# Altium project Monitor_Board_Model_temporary_H202.PrjPcb (part 1 of 3)
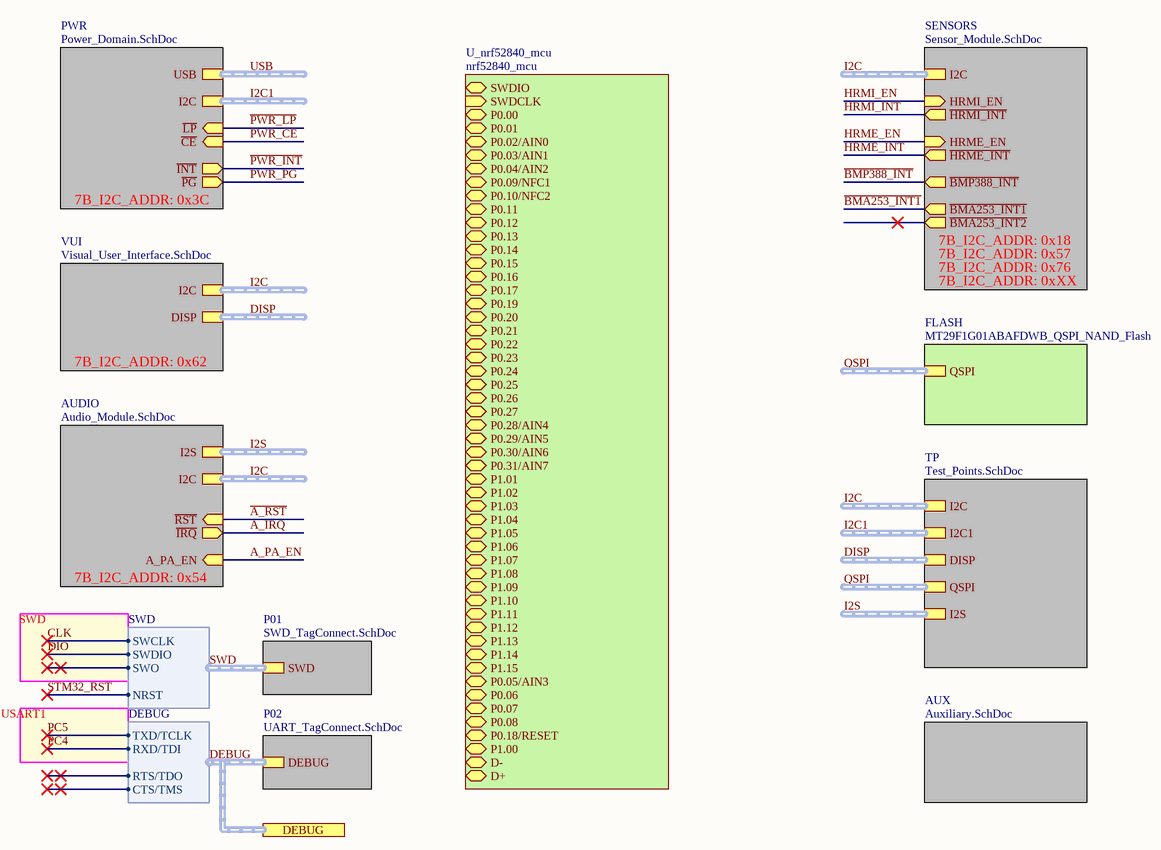
[diagram p0: Top_Schematic_Sheet.SchDoc]
_Title: Monitor_Board; _Revision: 0.1; _PCBNumber: temp; _PCBModel: H202; _HWEngineer: SGU; _DocumentDate: 20210408; _DateCode: 2021.04; _CompanyName: Acme_CPU; _BoardName: Monitor_Board; _ApprovedBy: PGU; _address2: Sheridan WY 82801; _address1: 30 N Gould St suite 4000
18 sheets, 90 parts. Net scope: hierarchical (ports join the sheet entries above them; power ports are global).
Board file: H202.PcbDoc
Sheets:
  Top_Schematic_Sheet.SchDoc
    TP = Test_Points.SchDoc
    PWR = Power_Domain.SchDoc
      USB = Micro_USB_Port.SchDoc
      BC = bq25157_Battery_Charger.SchDoc
      K_PAD = Membrane_Keypad.SchDoc
    VUI = Visual_User_Interface.SchDoc
    AUX = Auxiliary.SchDoc
    AUDIO = Audio_Module.SchDoc
      MIC1 = IM69D130_MEMS_Microphone.SchDoc
      MIC2 = IM69D130_MEMS_Microphone.SchDoc
      CODEC = CMX655D_Audio_CODEC_PA.SchDoc
    SENSORS = Sensor_Module.SchDoc
      HRME = Heartrate_Monitor_External.SchDoc
      HRMI = Heartrate_Monitor_Internal.SchDoc
        HRS1 = MAX30102_Heart-Rate_Sensor.SchDoc
    P01 = SWD_TagConnect.SchDoc
    P02 = UART_TagConnect.SchDoc
  SIT1533_Oscillator.SchDoc

## Sheet Top_Schematic_Sheet.SchDoc: H201 Monitor Board Block Diagram
size A4; DocumentNumber: 1; SheetNumber: 1; SheetTotal: 31

### Sub-sheets
AUDIO = Audio_Module.SchDoc: I2S (harness I2S), I2C (harness I2C), ~{RST} (in), ~{IRQ} (out), A_PA_EN (in)  | 7B_I2C_ADDR: 0x54
AUX = Auxiliary.SchDoc: no entries
FLASH = MT29F1G01ABAFDWB_QSPI_NAND_Flash (file not in this document): QSPI (harness QSPI)
P01 = SWD_TagConnect.SchDoc: SWD (harness SWD)  | Caption: SWD
P02 = UART_TagConnect.SchDoc: DEBUG (harness DEBUG)  | Caption: DEBUG
PWR = Power_Domain.SchDoc: USB (harness USB), I2C (harness I2C), ~{LP} (in), ~{PG} (out), ~{INT} (out), ~{CE} (in)  | 7B_I2C_ADDR: 0x3C
SENSORS = Sensor_Module.SchDoc: I2C (harness I2C), ~{BMA253_INT1} (out), ~{BMP388_INT} (out), ~{BMA253_INT2} (out), ~{HRMI_INT} (out), ~{HRME_INT} (out), HRMI_EN (in), HRME_EN (in)  | 7B_I2C_ADDR: 0x57; 7B_I2C_ADDR: 0x18; 7B_I2C_ADDR: 0x76; 7B_I2C_ADDR: 0xXX
TP = Test_Points.SchDoc: I2C (harness I2C), DISP (harness DISP_SPI), QSPI (harness QSPI), I2S (harness I2S), I2C1 (harness I2C)
U_nrf52840_mcu = nrf52840_mcu (file not in this document): SWDIO (bidir), SWDCLK (in), P0.00 (bidir), P0.01 (bidir), P0.02/AIN0 (bidir), P0.03/AIN1 (bidir), P0.04/AIN2 (bidir), P0.09/NFC1 (bidir), P0.10/NFC2 (bidir), P0.11 (bidir), P0.12 (bidir), P0.13 (bidir), P0.14 (bidir), P0.15 (bidir), P0.16 (bidir), P0.17 (bidir), P0.19 (bidir), P0.20 (bidir), P0.21 (bidir), P0.22 (bidir), P0.23 (bidir), P0.24 (bidir), P0.25 (bidir), P0.26 (bidir), P0.27 (bidir), P0.28/AIN4 (bidir), P0.29/AIN5 (bidir), P0.30/AIN6 (bidir), P0.31/AIN7 (bidir), P1.01 (bidir), P1.02 (bidir), P1.03 (bidir), P1.04 (bidir), P1.05 (bidir), P1.06 (bidir), P1.07 (bidir), P1.08 (bidir), P1.09 (bidir), P1.10 (bidir), P1.11 (bidir), P1.12 (bidir), P1.13 (bidir), P1.14 (bidir), P1.15 (bidir), P0.05/AIN3 (bidir), P0.06 (bidir), P0.07 (bidir), P0.08 (bidir), P0.18/RESET (bidir), P1.00 (bidir), D- (bidir), D+ (bidir)
VUI = Visual_User_Interface.SchDoc: I2C (harness I2C), DISP (harness DISP_SPI)  | 7B_I2C_ADDR: 0x62

### Ports
DEBUG (harness DEBUG)

### Harnesses
SWD: SWDIO, SWCLK, NRST, SWO
DEBUG: TXD/TCLK, RXD/TDI, RTS/TDO, CTS/TMS

### Buses and harness runs
harness DEBUG = port DEBUG = sheet P02/DEBUG
harness DISP = sheet TP/DISP
harness DISP = sheet VUI/DISP
harness I2C1 = sheet PWR/I2C
harness I2C1 = sheet TP/I2C1
harness I2C = sheet AUDIO/I2C
harness I2C = sheet SENSORS/I2C
harness I2C = sheet TP/I2C
harness I2C = sheet VUI/I2C
harness I2S = sheet AUDIO/I2S
harness I2S = sheet TP/I2S
harness QSPI = sheet FLASH/QSPI
harness QSPI = sheet TP/QSPI
harness SWD = sheet P01/SWD
harness USB = sheet PWR/USB

### Notes on the sheet
- SWD
- USART1
- Title
- Size:
- Date:
- A4
- Number:
- Time:
- Revision:
- Sheet
- of
- File:

## Sheet Test_Points.SchDoc: Test Points
size A4; DocumentNumber: 16; SheetNumber: 16; SheetTotal: 31
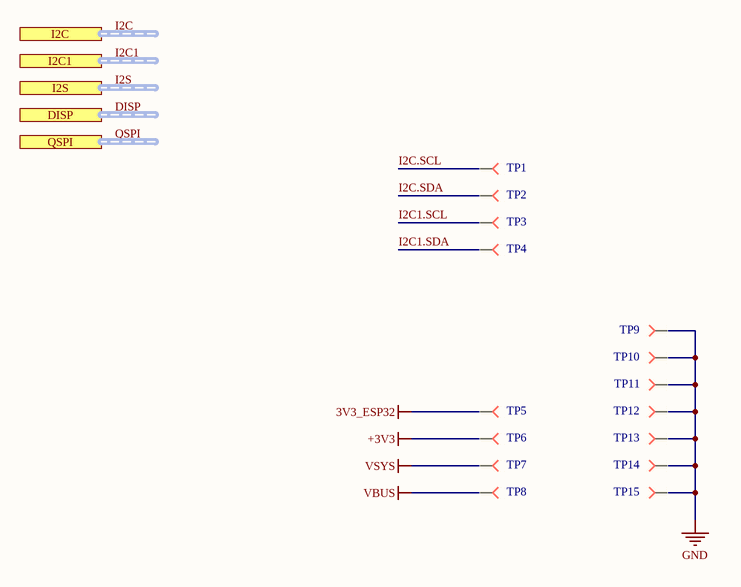
[diagram p1: Test_Points.SchDoc]

### Parts
TP1  Test Point Pad  [Testpoint]  (value not drawn)  (no BOM)
TP2  Test Point Pad  [Testpoint]  (value not drawn)  (no BOM)
TP3  Test Point Pad  [Testpoint]  (value not drawn)  (no BOM)
TP4  Test Point Pad  [Testpoint]  (value not drawn)  (no BOM)
TP5  Test Point Pad  [Testpoint]  (value not drawn)  (no BOM)
TP6  Test Point Pad  [Testpoint]  (value not drawn)  (no BOM)
TP7  Test Point Pad  [Testpoint]  (value not drawn)  (no BOM)
TP8  Test Point Pad  [Testpoint]  (value not drawn)  (no BOM)
TP9  Test Point Pad  [Testpoint]  (value not drawn)  (no BOM)
TP10  Test Point Pad  [Testpoint]  (value not drawn)  (no BOM)
TP11  Test Point Pad  [Testpoint]  (value not drawn)  (no BOM)
TP12  Test Point Pad  [Testpoint]  (value not drawn)  (no BOM)
TP13  Test Point Pad  [Testpoint]  (value not drawn)  (no BOM)
TP14  Test Point Pad  [Testpoint]  (value not drawn)  (no BOM)
TP15  Test Point Pad  [Testpoint]  (value not drawn)  (no BOM)

### Ports
DISP (harness DISP_SPI), I2C1 (harness I2C), I2C (harness I2C), I2S (harness I2S), QSPI (harness QSPI)

### Nets
3V3_ESP32: TP5.1
+3V3: TP6.1
GND: TP9.1 TP10.1 TP11.1 TP12.1 TP13.1 TP14.1 TP15.1
VBUS: TP8.1
VSYS: TP7.1
I2C1.SCL: TP3.1
I2C1.SDA: TP4.1
I2C.SCL: TP1.1
I2C.SDA: TP2.1

### Buses and harness runs
harness DISP = port DISP
harness I2C1 = port I2C1
harness I2C = port I2C
harness I2S = port I2S
harness QSPI = port QSPI

### Notes on the sheet
- Title
- Size:
- Date:
- A4
- Number:
- Time:
- Revision:
- Sheet
- of
- File:

### Library data of the parts
TP1-TP15 = Test Point Pad: Test Point. There is nothing to buy or mount.; ClassName: TestPoint; CompType: TestPoint; Manufacturer: N/A; MountType: N/A; PackageReference: TetsPoint; PartNumber: N/A

## Sheet Power_Domain.SchDoc: Power Domain
size A4; DocumentNumber: 11; SheetNumber: 11; SheetTotal: 31
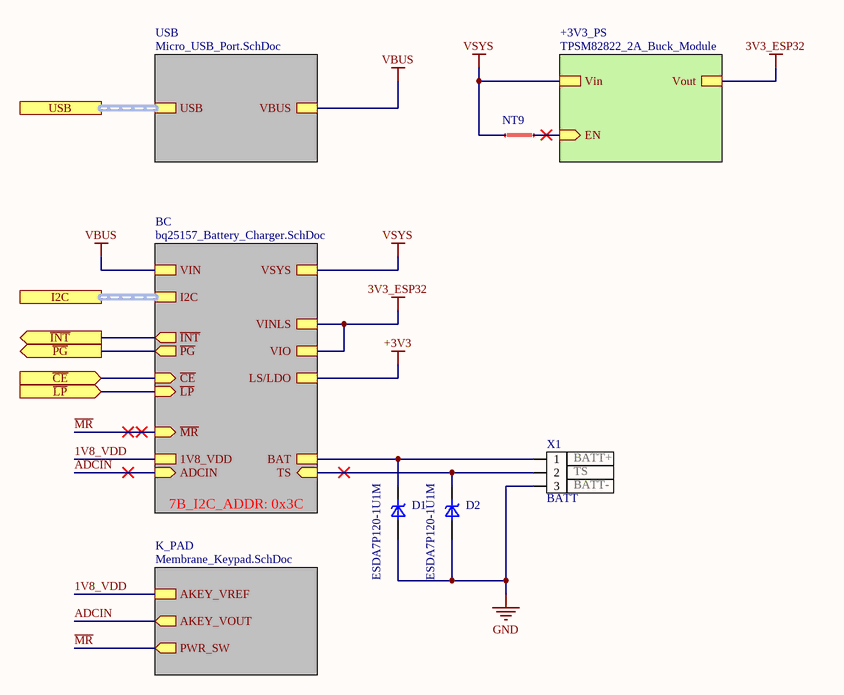
[diagram p2: Power_Domain.SchDoc]

### Parts
D1  ESDA7P120-1U1M  [ST_QFN_1610]
D2  ESDA7P120-1U1M  [ST_QFN_1610]
NT9  Net Tie  [Net Tie 1x3mm]  (value not drawn)  (net tie, no BOM)
X1  BATT  pin_1: BATT+  pin_2: TS  pin_3: BATT-  [JST_S3B-ZR-SM4A-TF]

### Sub-sheets
+3V3_PS = TPSM82822_2A_Buck_Module (file not in this document): Vout, Vin, EN (in)
BC = bq25157_Battery_Charger.SchDoc: VIN, VSYS, BAT, TS (in), ~{CE} (in), ~{LP} (in), ADCIN (in), ~{MR} (in), ~{INT} (out), ~{PG} (out), I2C (harness I2C), LS/LDO, VINLS, VIO, 1V8_VDD  | 7B_I2C_ADDR: 0x3C
K_PAD = Membrane_Keypad.SchDoc: PWR_SW (out), AKEY_VREF, AKEY_VOUT (out)
USB = Micro_USB_Port.SchDoc: USB (harness USB), VBUS

### Ports
I2C (harness I2C), USB (harness USB), ~{CE} (in), ~{INT} (out), ~{LP} (in), ~{PG} (out)

### Nets
3V3_ESP32: sheet BC/VINLS, sheet BC/VIO, sheet +3V3_PS/Vout
GND: D1.2(A) D2.2(A) X1.3
VBUS: sheet USB/VBUS, sheet BC/VIN
VSYS: NT9.2 ; sheet BC/VSYS, sheet +3V3_PS/Vin
1V8_VDD: sheet BC/1V8_VDD, sheet K_PAD/AKEY_VREF
~{MR}: sheet BC/~{MR}, sheet K_PAD/PWR_SW
~{PWR_CE}: port ~{CE}, sheet BC/~{CE}
~{PWR_INT}: port ~{INT}, sheet BC/~{INT}
~{PWR_LP}: port ~{LP}, sheet BC/~{LP}
~{PWR_PG}: port ~{PG}, sheet BC/~{PG}
ADCIN: sheet BC/ADCIN, sheet K_PAD/AKEY_VOUT
NetD1_1: D1.1(K) X1.1 ; sheet BC/BAT
NetD2_1: D2.1(K) X1.2 ; sheet BC/TS
NetNT9_1: NT9.1 ; sheet +3V3_PS/EN

### Buses and harness runs
harness port I2C = sheet BC/I2C
harness port USB = sheet USB/USB

### Notes on the sheet
- Title
- Size:
- Date:
- A4
- Number:
- Time:
- Revision:
- Sheet
- of
- File:

### Library data of the parts
D1 D2 = TVS DIODE ESDA7P120-1U1M 5.5V 11.5V 1610: 11.5V Clamp 120A (8/20µs) Ipp Tvs Diode Surface Mount 1610; Manufacturer: STMicroelectronics; Reverse Standoff Voltage: 5.5V; Number of Unidirectional Channels: 1; Min Breakdown Voltage: 6.4V; Peak Pulse Power: 1.4kW; Power Line Protection: No; Supplier 1: Digi-Key; Manufacturer Part Number: ESDA7P120-1U1M; Stock 1: 15775; Pricing 1: 1=0.35, 10=0.287, 25=0.2624, 100=0.1647, 250=0.1629, 500=0.1525, 1000=0.1037, 2500=0.0994 (USD); Packaging: Cut Tape; ComponentLink1URL: http://www.st.com/content/ccc/resource/technical/document/datasheet/group3/5e/7c/5d/76/3f/de/45/35/DM00359316/files/DM00359316.pdf/jcr:content/translations/en.DM00359316.pdf?src-supplier=Digi-Key; ComponentLink1Description: http://www.st.com/content/ccc/resource/technical/document/datasheet/group3/5e/7c/5d/76/3f/de/45/35/DM00359316/files/DM00359316.pdf/jcr:content/translations/en.DM00359316.pdf?src-supplier=Digi-Key; Supplier Part Number 1: 497-17159-1-ND; Mount: Surface Mount; Case/Package: 0603; Case Code (Imperial): 0603; Case Code (Metric): 1610; Min Operating Temperature: -55°C; Max Operating Temperature: 150°C; Composition: Zener; Clamping Voltage: 11.5V; Peak Pulse Current: 120A; ComponentLink2URL: http://www.farnell.com/datasheets/2815837.pdf?src-supplier=Newark; ComponentLink2Description: http://www.farnell.com/datasheets/2815837.pdf?src-supplier=Newark; ComponentLink3URL: http://www.farnell.com/datasheets/2815837.pdf?src-supplier=Farnell; ComponentLink3Description: http://www.farnell.com/datasheets/2815837.pdf?src-supplier=Farnell; ComponentLink4URL: http://www.farnell.com/datasheets/2815837.pdf?src-supplier=Element14; ComponentLink4Description: http://www.farnell.com/datasheets/2815837.pdf?src-supplier=Element14
NT9 = Net Tie Line: ClassName: Net Tie
X1 = CONN HEADER TH R/A 3POS 1.5MM: Connector Header Through Hole, Right Angle 3 position 0.059" (1.50mm); Manufacturer: JST; Manufacturer Part Number: S3B-ZR(LF)(SN); Number of Positions: 3; Connector Type: Male Pin; Voltage Rating: 50V; Contact Resistance: 30mR; Max Current Rating: 1A; Gender: Male; Pitch: 1.5mm; Body Plating: Tin; Insulation Resistance: 500MR; Panel Thickness: 3.5mm; Supplier 1: Digi-Key; Stock 1: 0; Mount: Through Hole; Number of Pins: 3; Color: Natural,White; Contact Plating: Tin,Copper; Contact Material: Brass,Copper,Tin; Housing Color: Beige; Housing Material: Polyamide; Min Operating Temperature: -25°C; Max Operating Temperature: 85°C; Packaging: Bulk; Number of Rows: 1; Termination: Press-Fit; Current Rating: 1A; Fastening Type: Detent; Max Voltage Rating (AC): 50V; Number of Contacts: 3; Orientation: Right Angle; Length: 6mm; Height: 7.2mm; Width: 3.5mm; Depth: 6mm; Contact Mating Length: 0.094inch; Lead Free: Lead Free; ComponentLink1URL: http://www.jst-mfg.com/product/pdf/eng/eZH.pdf?src-supplier=Digi-Key; ComponentLink1Description: http://www.jst-mfg.com/product/pdf/eng/eZH.pdf?src-supplier=Digi-Key; ComponentLink2URL: https://www.verical.com/server-webapp/html/getDatasheet?partID=722697&src-supplier=Verical; ComponentLink2Description: https://www.verical.com/server-webapp/html/getDatasheet?partID=722697&src-supplier=Verical; ComponentLink3URL: http://www.produktinfo.conrad.com/datenblaetter/725000-749999/741155-da-01-en-STIFTLEISTE_GEWINKELT_3_POL_RM1_5.pdf?src-supplier=Conrad; ComponentLink3Description: http://www.produktinfo.conrad.com/datenblaetter/725000-749999/741155-da-01-en-STIFTLEISTE_GEWINKELT_3_POL_RM1_5.pdf?src-supplier=Conrad; Supplier Part Number 1: 455-1670-ND; Pricing 1: 1=0.2, 10=0.184, 100=0.1274, 500=0.1078, 1000=0.0882, 5000=0.0784, 10000=0.071 (USD); Material: Nylon; Voltage Rating (AC): 50V; Voltage Rating (DC): 50V; Lead Pitch: 1.5mm; REACH SVHC: No SVHC; Flammability Rating: UL94 V-0

## Sheet Micro_USB_Port.SchDoc: Micro USB Port
size A4; DocumentNumber: 12; SheetNumber: 12; SheetTotal: 31
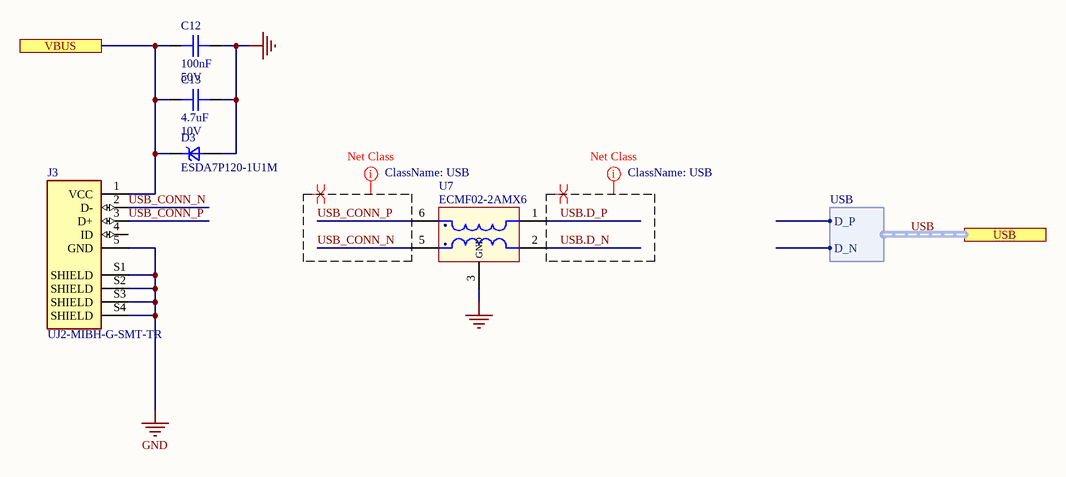
[diagram p3: Micro_USB_Port.SchDoc]

### Parts
C12  Capacitance: 100nF  Voltage: 50V  [C0402]
C13  Capacitance: 4.7uF  Voltage Rating: 10V  [0603C]
D3  ESDA7P120-1U1M  [ST_QFN_1610]
J3  UJ2-MIBH-G-SMT-TR  [CUI_UJ2-MIBH-G-SMT-TR]
U7  ECMF02-2AMX6  [QFN-6L]

### Ports
USB (harness USB), VBUS

### Harnesses
USB: D_P, D_N

### Nets
GND: C12.1 C13.1 D3.2(A) J3.5(GND) J3.S1(SHIELD) J3.S2(SHIELD) J3.S3(SHIELD) J3.S4(SHIELD) U7.3(GND)
VBUS: C12.2 C13.2 D3.1(K) J3.1(VCC) ; port VBUS
USB.D_N: U7.2(INP2)
USB.D_P: U7.1(INP1)
USB_CONN_N: J3.2(D-) U7.5(OUT2)
USB_CONN_P: J3.3(D+) U7.6(OUT1)

Not connected (* = marked no-connect by the designer): J3 4(ID); U7 4(NC)

### Buses and harness runs
harness USB = port USB

### Layout directives
differential pair: USB.D_N, USB.D_P, USB_CONN_N, USB_CONN_P
net class USB: USB.D_N, USB.D_P, USB_CONN_N, USB_CONN_P

### Notes on the sheet
- Title
- Size:
- Date:
- A4
- Number:
- Time:
- Revision:
- Sheet
- of
- File:

### Library data of the parts
C12 = CAP CER 0.1UF 50V X7R 0402: 0.1µF ±10% 50V Ceramic Capacitor X7R 0402 (1005 Metric); Manufacturer: TDK; Manufacturer Part Number: CGA2B3X7R1H104K050BB; Supplier 1: Digi-Key; Stock 1: 2925303; Pricing 1: 1=0.17, 10=0.118, 50=0.0668, 100=0.0553, 500=0.0388, 1000=0.0321, 2500=0.0299, 5000=0.0273 (USD); Mount: Surface Mount; Case/Package: 0402; Weight: 2.3E-05oz; Case Code (Metric): 1005; Case Code (Imperial): 0402; Min Operating Temperature: -55°C; Max Operating Temperature: 125°C; Voltage Rating: 50V; Tolerance: 10%; Packaging: Tape and Reel; Package Quantity: 1; Voltage Rating (DC): 50V; Dielectric: X7R; Termination: SMD/SMT; Composition: Ceramic; Length: 1mm; Height: 0.5mm; Width: 0.02inch; Thickness: 0.022inch; Depth: 0.5mm; Ratings: AEC-Q200; REACH SVHC: No SVHC; Lead Free: Lead Free; ComponentLink1URL: http://product.tdk.com/capacitor/mlcc/en/documents/mlccspec_automotive_general_midvoltage_en.pdf?src-supplier=Future+Electronics; ComponentLink1Description: http://product.tdk.com/capacitor/mlcc/en/documents/mlccspec_automotive_general_midvoltage_en.pdf?src-supplier=Future+Electronics; ComponentLink2URL: http://www.farnell.com/datasheets/1807242.pdf?src-supplier=Element14; ComponentLink2Description: http://www.farnell.com/datasheets/1807242.pdf?src-supplier=Element14; ComponentLink3URL: http://www.mouser.com/ds/2/400/lcc_automotive_general_en-843974.pdf?src-supplier=Mouser; ComponentLink3Description: http://www.mouser.com/ds/2/400/lcc_automotive_general_en-843974.pdf?src-supplier=Mouser; ComponentLink4URL: http://www.farnell.com/datasheets/1936565.pdf?src-supplier=Element14; ComponentLink4Description: http://www.farnell.com/datasheets/1936565.pdf?src-supplier=Element14; ComponentLink5URL: http://www.farnell.com/datasheets/1735392.pdf?src-supplier=Element14; ComponentLink5Description: http://www.farnell.com/datasheets/1735392.pdf?src-supplier=Element14; Supplier Part Number 1: 445-6899-1-ND
C13 = CAP CER 4.7UF 10V X5R 0603: 4.7µF ±10% 10V Ceramic Capacitor X5R 0603 (1608 Metric); Manufacturer: Yageo; Manufacturer Part Number: CC0603KRX5R6BB475; Supplier 1: Digi-Key; Stock 1: 325858; Pricing 1: 1=0.26, 10=0.18, 100=0.102, 500=0.072, 1000=0.063 (USD); Mount: Surface Mount; Case Code (Imperial): 0603; Case Code (Metric): 1608; Min Operating Temperature: -55°C; Max Operating Temperature: 85°C; Tolerance: 10%; Packaging: Tape and Reel; Voltage Rating (DC): 10V; Dielectric: X5R; Termination: SMD/SMT; Composition: Ceramic; Length: 1.6mm; Height: 0.8mm; Width: 0.8mm; Depth: 0.8mm; Thickness: 0.035inch; Radiation Hardening: No; Lead Free: Lead Free; Halogen Free: Halogen Free; ComponentLink1URL: http://www.farnell.com/datasheets/2167237.pdf?src-supplier=Element14; ComponentLink1Description: http://www.farnell.com/datasheets/2167237.pdf?src-supplier=Element14; Supplier Part Number 1: 311-1455-1-ND; Case/Package: 0603; Package Quantity: 1; REACH SVHC: Unknown; ComponentLink2URL: http://www.yageo.com/documents/recent/UPY-GPHC_X5R_4V-to-50V_25.pdf?src-supplier=Digi-Key; ComponentLink2Description: http://www.yageo.com/documents/recent/UPY-GPHC_X5R_4V-to-50V_25.pdf?src-supplier=Digi-Key; ComponentLink3URL: http://www.yageo.com/documents/recent/UPY-GPHC_X5R_4V-to-50V_12.pdf?src-supplier=Avnet; ComponentLink3Description: http://www.yageo.com/documents/recent/UPY-GPHC_X5R_4V-to-50V_12.pdf?src-supplier=Avnet; ComponentLink4URL: http://www.yageo.com/documents/recent/UPY-GPHC_X5R_4V-to-50V_12.pdf?src-supplier=Avnet+Europe; ComponentLink4Description: http://www.yageo.com/documents/recent/UPY-GPHC_X5R_4V-to-50V_12.pdf?src-supplier=Avnet+Europe
D3 = TVS DIODE ESDA7P120-1U1M 5.5V 11.5V 1610: 11.5V Clamp 120A (8/20µs) Ipp Tvs Diode Surface Mount 1610; Manufacturer: STMicroelectronics; Number of Unidirectional Channels: 1; Reverse Standoff Voltage: 5.5V; Min Breakdown Voltage: 6.4V; Peak Pulse Power: 1.4kW; Power Line Protection: No; Supplier 1: Digi-Key; Manufacturer Part Number: ESDA7P120-1U1M; Stock 1: 15775; Pricing 1: 1=0.35, 10=0.287, 25=0.2624, 100=0.1647, 250=0.1629, 500=0.1525, 1000=0.1037, 2500=0.0994 (USD); Mount: Surface Mount; Case/Package: 0603; Min Operating Temperature: -55°C; Max Operating Temperature: 150°C; Composition: Zener; Packaging: Cut Tape; Clamping Voltage: 11.5V; Peak Pulse Current: 120A; ComponentLink1URL: http://www.st.com/content/ccc/resource/technical/document/datasheet/group3/5e/7c/5d/76/3f/de/45/35/DM00359316/files/DM00359316.pdf/jcr:content/translations/en.DM00359316.pdf?src-supplier=Digi-Key; ComponentLink1Description: http://www.st.com/content/ccc/resource/technical/document/datasheet/group3/5e/7c/5d/76/3f/de/45/35/DM00359316/files/DM00359316.pdf/jcr:content/translations/en.DM00359316.pdf?src-supplier=Digi-Key; ComponentLink2URL: http://www.farnell.com/datasheets/2815837.pdf?src-supplier=Newark; ComponentLink2Description: http://www.farnell.com/datasheets/2815837.pdf?src-supplier=Newark; ComponentLink3URL: http://www.farnell.com/datasheets/2815837.pdf?src-supplier=Farnell; ComponentLink3Description: http://www.farnell.com/datasheets/2815837.pdf?src-supplier=Farnell; ComponentLink4URL: http://www.farnell.com/datasheets/2815837.pdf?src-supplier=Element14; ComponentLink4Description: http://www.farnell.com/datasheets/2815837.pdf?src-supplier=Element14; Supplier Part Number 1: 497-17159-1-ND; Case Code (Imperial): 0603; Case Code (Metric): 1610
J3 = UJ2-MIBH-G-SMT-TR: Micro B, USB 2.0, 1.8 A, Right Angle, Surface Mount (SMT), USB Receptacle; MF: CUI Devices; Check_prices: https://www.snapeda.com/parts/UJ2-MIBH-G-SMT-TR/CUI%20Devices/view-part/5487872/?ref=eda; Availability: Warning; CUI_purchase_URL: https://www.cuidevices.com/product/interconnect/connectors/usb-connectors/uj2-mibh-g-smt-tr?utm_source=snapeda.com&utm_medium=referral&utm_campaign=snapedaBOM; Price: None; Package: None; Value: *; Purchase-URL: https://pricing.snapeda.com/search/part/UJ2-MIBH-G-SMT-TR/?ref=eda; SnapEDA_Link: https://www.snapeda.com/parts/UJ2-MIBH-G-SMT-TR/CUI%20Devices/view-part/5487872/?ref=snap; MP: UJ2-MIBH-G-SMT-TR
U7 = CMC 200MA 2LN SMD ESD: 2 Line Common Mode Choke Surface Mount  200mA DCR 2.5Ohm; Manufacturer: STMicroelectronics; Number of Lines: 2; DC Resistance (DCR): 2.5R; Supplier 1: Digi-Key; Manufacturer Part Number: ECMF02-2AMX6; Stock 1: 23653; Pricing 1: 1=0.48, 10=0.418, 25=0.3888, 50=0.3288, 100=0.2989, 250=0.281, 500=0.2511, 1000=0.2033 (USD); Mount: Surface Mount; Case/Package: QFN; Number of Pins: 6; Min Operating Temperature: -40°C; Max Operating Temperature: 85°C; Packaging: Tape and Reel; Package Quantity: 1; Current: 200mA; Termination: Flat; Max Current Rating: 200mA; Current Rating: 200mA; Length: 1.75mm; Height: 0.022inch; Width: 0.059inch; Depth: 1.55mm; Radiation Hardening: No; Lead Free: Lead Free; REACH SVHC: No SVHC; ComponentLink1URL: http://www.st.com/web/en/resource/technical/document/datasheet/CD00282307.pdf?src-supplier=Future+Electronics; ComponentLink1Description: http://www.st.com/web/en/resource/technical/document/datasheet/CD00282307.pdf?src-supplier=Future+Electronics; ComponentLink2URL: http://www.st.com/content/ccc/resource/technical/document/datasheet/3a/28/cf/d0/31/63/48/8c/CD00282307.pdf/files/CD00282307.pdf/jcr:content/translations/en.CD00282307.pdf?src-supplier=Digi-Key; ComponentLink2Description: http://www.st.com/content/ccc/resource/technical/document/datasheet/3a/28/cf/d0/31/63/48/8c/CD00282307.pdf/files/CD00282307.pdf/jcr:content/translations/en.CD00282307.pdf?src-supplier=Digi-Key; ComponentLink3URL: http://www.mouser.com/ds/2/389/ecmf02-2amx6-954491.pdf?src-supplier=Mouser; ComponentLink3Description: http://www.mouser.com/ds/2/389/ecmf02-2amx6-954491.pdf?src-supplier=Mouser; ComponentLink4URL: https://www.verical.com/server-webapp/html/getDatasheet?partID=259862&src-supplier=Verical; ComponentLink4Description: https://www.verical.com/server-webapp/html/getDatasheet?partID=259862&src-supplier=Verical; Supplier Part Number 1: 497-10773-1-ND

## Sheet bq25157_Battery_Charger.SchDoc: BQ25157 Battery Charger
size A4; DocumentNumber: 14; SheetNumber: 14; SheetTotal: 31
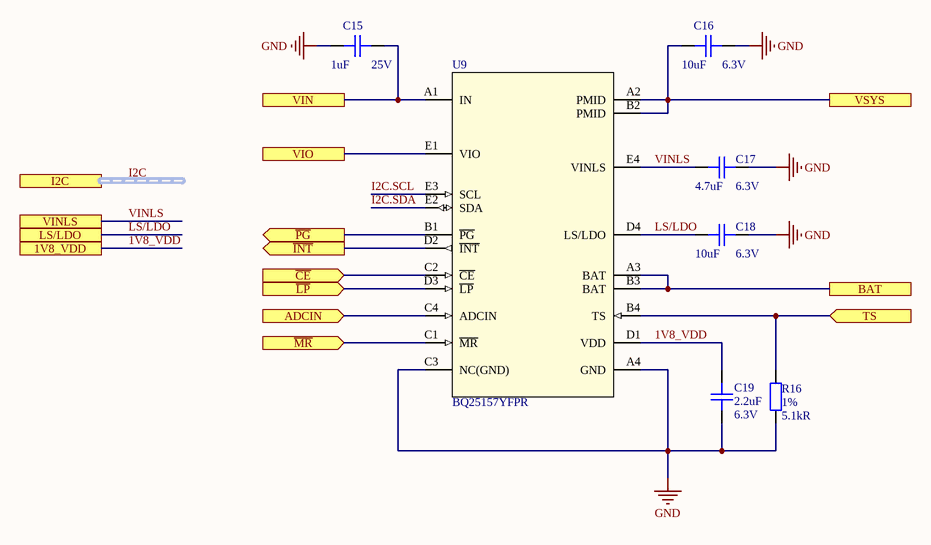
[diagram p4: bq25157_Battery_Charger.SchDoc]

### Parts
C15  Capacitance: 1uF  Voltage Rating: 25V  [CAP_0603]  (hidden comment: CAP CER 1UF 25V X5R 0603)
C16  Capacitance: 10uF  Voltage Rating: 6.3V  [C0402]  (hidden comment: CAP CER 10UF 6.3V X5R 0402)
C17  Capacitance: 4.7uF  Voltage Rating: 6.3V  [C0402]  (hidden comment: CAP CER 4.7UF 6.3V X5R 0402)
C18  Capacitance: 10uF  Voltage Rating: 6.3V  [C0402]  (hidden comment: CAP CER 10UF 6.3V X5R 0402)
C19  Capacitance: 2.2uF  Voltage: 6.3V  [C0402]  (hidden comment: CAP CER 2.2UF 6.3V X5R 0402)
R16  Tolerance: 1%  Resistance: 5.1kR  [R_0402]  (hidden comment: RES SMD 5.1K OHM 1% 1/16W 0402)
U9  BQ25157YFPR  [YFP0020]

### Ports
1V8_VDD, ADCIN (in), BAT, I2C (harness I2C), LS/LDO, TS (in), VIN, VINLS, VIO, VSYS, ~{CE} (in), ~{INT} (out), ~{LP} (in), ~{MR} (in), ~{PG} (out)

### Nets
GND: C15.1 C16.2 C17.2 C18.2 C19.1 R16.1 U9.A4(GND) U9.C3(NC(GND))
LS/LDO: C18.1 U9.D4(LS/LDO) ; port LS/LDO  [project net +3V3]
VBUS: C15.2 U9.A1(IN) ; port VIN
VINLS: C17.1 U9.E1(VIO) U9.E4(VINLS) ; port VIO, port VINLS  [project net 3V3_ESP32]
VSYS: C16.1 U9.A2(PMID) U9.B2(PMID) ; port VSYS
1V8_VDD: C19.2 U9.D1(VDD) ; port 1V8_VDD
~{MR}: U9.C1(~{MR}) ; port ~{MR}
~{PWR_CE}: U9.C2(~{CE}) ; port ~{CE}
~{PWR_INT}: U9.D2(~{INT}) ; port ~{INT}
~{PWR_LP}: U9.D3(~{LP}) ; port ~{LP}
~{PWR_PG}: U9.B1(~{PG}) ; port ~{PG}
ADCIN: U9.C4(ADCIN) ; port ADCIN
I2C.SCL: U9.E3(SCL)
I2C.SDA: U9.E2(SDA)
NetD1_1: U9.A3(BAT) U9.B3(BAT) ; port BAT
NetD2_1: R16.2 U9.B4(TS) ; port TS

### Buses and harness runs
harness I2C = port I2C

### Notes on the sheet
- Title
- Size:
- Date:
- A4
- Number:
- Time:
- Revision:
- Sheet
- of
- File:

### Library data of the parts
C15 = CAP CER 1UF 25V X5R 0603: 1µF ±20% 25V Ceramic Capacitor X5R 0603 (1608 Metric); Manufacturer: Yageo; Manufacturer Part Number: CC0603MRX5R8BB105; Supplier 1: Digi-Key; Stock 1: 31570; Pricing 1: 1=0.13, 10=0.093, 50=0.0528, 100=0.0438, 500=0.0307, 1000=0.0254 (USD); Mount: Surface Mount; Case Code (Imperial): 0603; Case Code (Metric): 1608; Min Operating Temperature: -55°C; Max Operating Temperature: 85°C; Tolerance: 20%; Packaging: Tape and Reel; Voltage Rating (DC): 25V; Dielectric: X5R; Length: 0.063inch; Width: 0.031inch; Thickness: 0.035inch; Lead Free: Lead Free; ComponentLink1URL: http://www.yageo.com/exep/pages/download/literatures/ProductSelectionGuide%202014_Final_2.pdf?src-supplier=Digi-Key; ComponentLink1Description: http://www.yageo.com/exep/pages/download/literatures/ProductSelectionGuide%202014_Final_2.pdf?src-supplier=Digi-Key; Supplier Part Number 1: 311-1823-1-ND; Case/Package: 0603; ComponentLink2URL: http://www.yageo.com/documents/recent/UPY-GPHC_X5R_4V-to-50V_25.pdf?src-supplier=Digi-Key; ComponentLink2Description: http://www.yageo.com/documents/recent/UPY-GPHC_X5R_4V-to-50V_25.pdf?src-supplier=Digi-Key; Halogen Free: Halogen Free
C16 C18 = CAP CER 10UF 6.3V X5R 0402: 10µF ±20% 6.3V Ceramic Capacitor X5R 0402 (1005 Metric); Manufacturer: Samsung; Manufacturer Part Number: CL05A106MQ5NUNC; Supplier 1: Digi-Key; Stock 1: 1544395; Pricing 1: 1=0.27, 10=0.187, 50=0.1248, 100=0.1061, 500=0.0749, 1000=0.0655, 2500=0.0624, 5000=0.0577 (USD); Mount: Surface Mount; Case/Package: 0402; Case Code (Metric): 1005; Case Code (Imperial): 0402; Min Operating Temperature: -55°C; Max Operating Temperature: 85°C; Tolerance: 20%; Dielectric: X5R; Packaging: Tape and Reel; Package Quantity: 1; Series: CL; Construction: Flat; Length: 1mm; Width: 0.02inch; Height: 0.5mm; Thickness: 0.028inch; Depth: 0.5mm; Radiation Hardening: No; ComponentLink1URL: https://www.verical.com/server-webapp/html/getDatasheet?partID=355289&src-supplier=Verical; ComponentLink1Description: https://www.verical.com/server-webapp/html/getDatasheet?partID=355289&src-supplier=Verical; ComponentLink2URL: http://www1.futureelectronics.com/doc/SAMSUNG/CL05A106MQ5NUNC.pdf?src-supplier=Future+Electronics; ComponentLink2Description: http://www1.futureelectronics.com/doc/SAMSUNG/CL05A106MQ5NUNC.pdf?src-supplier=Future+Electronics; Supplier Part Number 1: 1276-1451-1-ND
C17 = CAP CER 4.7UF 6.3V X5R 0402: 4.7µF ±20% 6.3V Ceramic Capacitor X5R 0402 (1005 Metric); Manufacturer: Samsung; Manufacturer Part Number: CL05A475MQ5NRNC; Supplier 1: Digi-Key; Stock 1: 746765; Pricing 1: 1=0.14, 10=0.099, 50=0.0564, 100=0.0467, 500=0.0327, 1000=0.0271, 2500=0.0252, 5000=0.0231 (USD); Mount: Surface Mount; Case/Package: 0402; Case Code (Metric): 1005; Case Code (Imperial): 0402; Min Operating Temperature: -55°C; Max Operating Temperature: 85°C; Tolerance: 20%; Packaging: Tape and Reel; Series: CL; Length: 0.039inch; Width: 0.02inch; Thickness: 0.022inch; RoHS Compliant: Yes; ComponentLink1URL: https://www.verical.com/server-webapp/html/getDatasheet?partID=359681&src-supplier=Verical; ComponentLink1Description: https://www.verical.com/server-webapp/html/getDatasheet?partID=359681&src-supplier=Verical; ComponentLink2URL: http://www1.futureelectronics.com/doc/SAMSUNG/CL05A475MQ5NRNC.pdf?src-supplier=Future+Electronics; ComponentLink2Description: http://www1.futureelectronics.com/doc/SAMSUNG/CL05A475MQ5NRNC.pdf?src-supplier=Future+Electronics; Supplier Part Number 1: 1276-1056-1-ND
C19 = CAP CER 2.2UF 6.3V X5R 0402: 2.2µF ±20% 6.3V Ceramic Capacitor X5R 0402 (1005 Metric); Manufacturer: Murata; Manufacturer Part Number: GRM155R60J225ME15D; Supplier 1: Digi-Key; Stock 1: 4444410; Pricing 1: 1=0.29, 10=0.199, 100=0.1009, 500=0.0691, 1000=0.0611, 2500=0.0584, 5000=0.0531 (USD); Mount: Surface Mount; Case/Package: 0402; Case Code (Metric): 1005; Material: Ceramic; Min Operating Temperature: -55°C; Max Operating Temperature: 85°C; Tolerance: 20%; Dielectric: X5R; Packaging: Tape and Reel; Package Quantity: 10000; Voltage Rating: 6.3V; Voltage Rating (DC): 6.3V; Termination: SMD/SMT; Length: 1mm; Height: 0.5mm; Width: 0.02inch; Thickness: 0.022inch; Depth: 0.5mm; Radiation Hardening: No; REACH SVHC: No SVHC; Lead Free: Lead Free; ComponentLink1URL: https://www.murata.com/~/media/webrenewal/support/library/catalog/products/capacitor/mlcc/c02e.ashx?la=en-us&src-supplier=Digi-Key; ComponentLink1Description: https://www.murata.com/~/media/webrenewal/support/library/catalog/products/capacitor/mlcc/c02e.ashx?la=en-us&src-supplier=Digi-Key; ComponentLink2URL: http://www.murata.com/~/media/webrenewal/support/library/catalog/products/capacitor/mlcc/c02e.ashx?src-supplier=Avnet; ComponentLink2Description: http://www.murata.com/~/media/webrenewal/support/library/catalog/products/capacitor/mlcc/c02e.ashx?src-supplier=Avnet; ComponentLink3URL: http://www.farnell.com/datasheets/2047859.pdf?src-supplier=Element14; ComponentLink3Description: http://www.farnell.com/datasheets/2047859.pdf?src-supplier=Element14; ComponentLink4URL: https://produktinfo.conrad.com/datenblaetter/450000-474999/450128-da-01-de-VS_KONDENS_GRM155_R60J_225ME15D.pdf?src-supplier=Conrad; ComponentLink4Description: https://produktinfo.conrad.com/datenblaetter/450000-474999/450128-da-01-de-VS_KONDENS_GRM155_R60J_225ME15D.pdf?src-supplier=Conrad; Supplier Part Number 1: 490-4519-1-ND; Case Code (Imperial): 0402
R16 = RES SMD 5.1K OHM 1% 1/16W 0402: 5.1 kOhms ±1% 0.063W, 1/16W Chip Resistor 0402 (1005 Metric) Moisture Resistant Thick Film; Manufacturer: Yageo; Manufacturer Part Number: RC0402FR-075K1L; Max Power Dissipation: 63mW; Temperature Coefficient: 100ppm/°C; Voltage Rating (DC): 50V; Supplier 1: Digi-Key; Stock 1: 19803; Pricing 1: 1=0.1, 10=0.016, 100=0.0064, 1000=0.0029, 2500=0.0025, 5000=0.0021 (USD); Case/Package: 0402; Case Code (Metric): 1005; Case Code (Imperial): 0402; Min Operating Temperature: -55°C; Max Operating Temperature: 155°C; Packaging: Tape and Reel; Composition: Thick Film; Number of Terminations: 2; Package Quantity: 1; Power Rating: 63mW; Military Standard: Not; Features: Moisture Resistant; Voltage Rating: 50V; Termination: SMD/SMT; Working Voltage: 50V; Length: 1mm; Height: 0.016inch; Width: 0.02inch; Depth: 0.5mm; Lead Free: Lead Free; REACH SVHC: Unknown; ComponentLink1URL: https://www.verical.com/server-webapp/html/getDatasheet?partID=323636&src-supplier=Verical; ComponentLink1Description: https://www.verical.com/server-webapp/html/getDatasheet?partID=323636&src-supplier=Verical; ComponentLink2URL: http://www.yageo.com/documents/recent/PYu-RC_Group_51_RoHS_L_10.pdf?src-supplier=Digi-Key; ComponentLink2Description: http://www.yageo.com/documents/recent/PYu-RC_Group_51_RoHS_L_10.pdf?src-supplier=Digi-Key; ComponentLink3URL: http://www.farnell.com/datasheets/2167052.pdf?src-supplier=Element14; ComponentLink3Description: http://www.farnell.com/datasheets/2167052.pdf?src-supplier=Element14; ComponentLink4URL: http://www.yageo.com/documents/recent/PYu-RC0402_51_RoHS_L_6_r.pdf?src-supplier=Future+Electronics; ComponentLink4Description: http://www.yageo.com/documents/recent/PYu-RC0402_51_RoHS_L_6_r.pdf?src-supplier=Future+Electronics; ComponentLink5URL: http://www.yageo.com/documents/recent/PYu-RC0402_51_RoHS_L_6_r.pdf?src-supplier=Mouser; ComponentLink5Description: http://www.yageo.com/documents/recent/PYu-RC0402_51_RoHS_L_6_r.pdf?src-supplier=Mouser; ComponentLink6URL: http://www.farnell.com/datasheets/1018594.pdf?src-supplier=Element14; ComponentLink6Description: http://www.farnell.com/datasheets/1018594.pdf?src-supplier=Element14; Supplier Part Number 1: 311-5.10KLRCT-ND
U9 = IC BQ25157YFPR BATT CHG LI-ION 1CELL 20DSBGA: Charger IC Lithium Ion/Polymer 20-DSBGA (2.02x1.62); Manufacturer: Texas Instruments; Supplier 1: Digi-Key; Manufacturer Part Number: BQ25157YFPR; Stock 1: 0; Pricing 1: 1=2.97, 10=2.664, 25=2.5184, 100=2.0708, 250=1.8581, 500=1.791, 1000=1.4888 (USD); ComponentLink1URL: https://octopart.com/click/track?ai=10049&ct=datasheets&sig=0484d06&at=physicalpart&sid=370&ppid=114161831&hlid=31393893&src-supplier=TI+store; ComponentLink1Description: https://octopart.com/click/track?ai=10049&ct=datasheets&sig=0484d06&at=physicalpart&sid=370&ppid=114161831&hlid=31393893&src-supplier=TI+store; Supplier Part Number 1: 296-BQ25157YFPRCT-ND